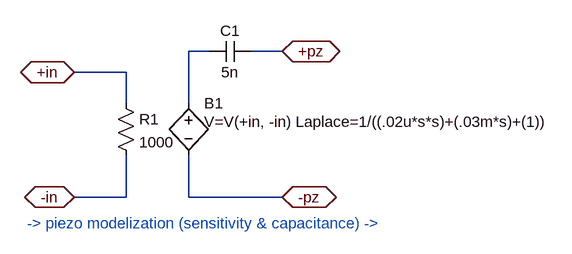
[diagram p0: schematic Piezo_1k_3.asc]
Piezo_1k_3.asc, the LTspice schematic file:
Version 4
SHEET 1 1124 680
WIRE 48 -80 16 -80
WIRE 160 -80 112 -80
WIRE -80 -48 -160 -48
WIRE -80 0 -80 -48
WIRE 16 0 16 -80
WIRE -80 144 -80 80
WIRE -80 144 -160 144
WIRE 16 144 16 80
WIRE 160 144 16 144
FLAG -160 -48 +in
IOPIN -160 -48 BiDir
FLAG -160 144 -in
IOPIN -160 144 BiDir
FLAG 160 -80 +pz
IOPIN 160 -80 BiDir
FLAG 160 144 -pz
IOPIN 160 144 BiDir
SYMBOL bv 16 -16 R0
WINDOW 3 24 44 Left 0
SYMATTR Value V=V(+in, -in) Laplace=1/((.02u*s*s)+(.03m*s)+(1))
SYMATTR InstName B1
SYMBOL res -96 -16 R0
SYMATTR InstName R1
SYMATTR Value 1000
SYMBOL cap 112 -96 R90
WINDOW 0 0 32 VBottom 0
WINDOW 3 32 32 VTop 0
SYMATTR InstName C1
SYMATTR Value 5n
TEXT -232 184 Left 0 ;-> piezo modelization (sensitivity & capacitance) ->

The netlist it stands for:
* Piezo_1k_3.asc
B1 N001 -pz V=V(+in, -in) Laplace=1/((.02u*s*s)+(.03m*s)+(1))
R1 +in -in 1000
C1 +pz N001 5n
* -> piezo modelization (sensitivity & capacitance) ->
.backanno
.end